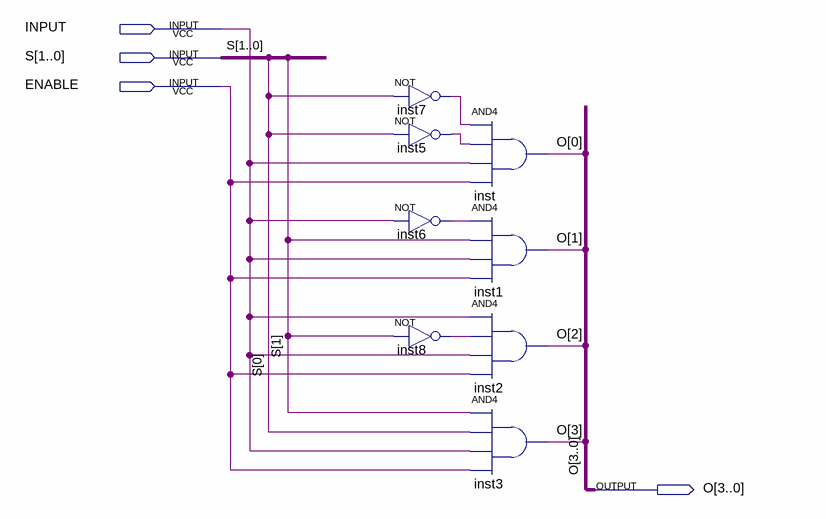
[diagram p0: schematic sheet]
// Quartus schematic DEMUX_1X4.bdf as structural Verilog: 8 symbols, 4 pins
module DEMUX_1X4 (
  input  INPUT,
  input  [1:0] S,
  input  ENABLE,
  output [3:0] O
);

  wire inst5_out, inst6_out, inst7_out, inst8_out;

  not inst7 (inst7_out, S[0]);
  not inst5 (inst5_out, S[0]);
  not inst6 (inst6_out, INPUT);
  not inst8 (inst8_out, S[1]);
  and inst (O[0], inst7_out, inst5_out, INPUT, ENABLE);
  and inst1 (O[1], inst6_out, S[1], INPUT, ENABLE);
  and inst2 (O[2], INPUT, inst8_out, INPUT, ENABLE);
  and inst3 (O[3], S[1], S[0], INPUT, ENABLE);
endmodule
